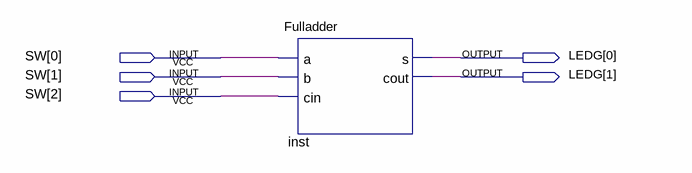
[diagram p0: schematic sheet]
// Quartus schematic Fulladder.bdf as structural Verilog: 1 symbols, 5 pins
module Fulladder (
  input  [2:0] SW,
  output [1:0] LEDG
);

  Fulladder inst (.a(SW[0]), .b(SW[1]), .cin(SW[2]), .s(LEDG[0]), .cout(LEDG[1]));
endmodule
